# Altium schematic sheet Sensor_PCI_Sch_V2.SchDoc
size 342 x 292 mm; SheetNumber: 1; SheetTotal: 1
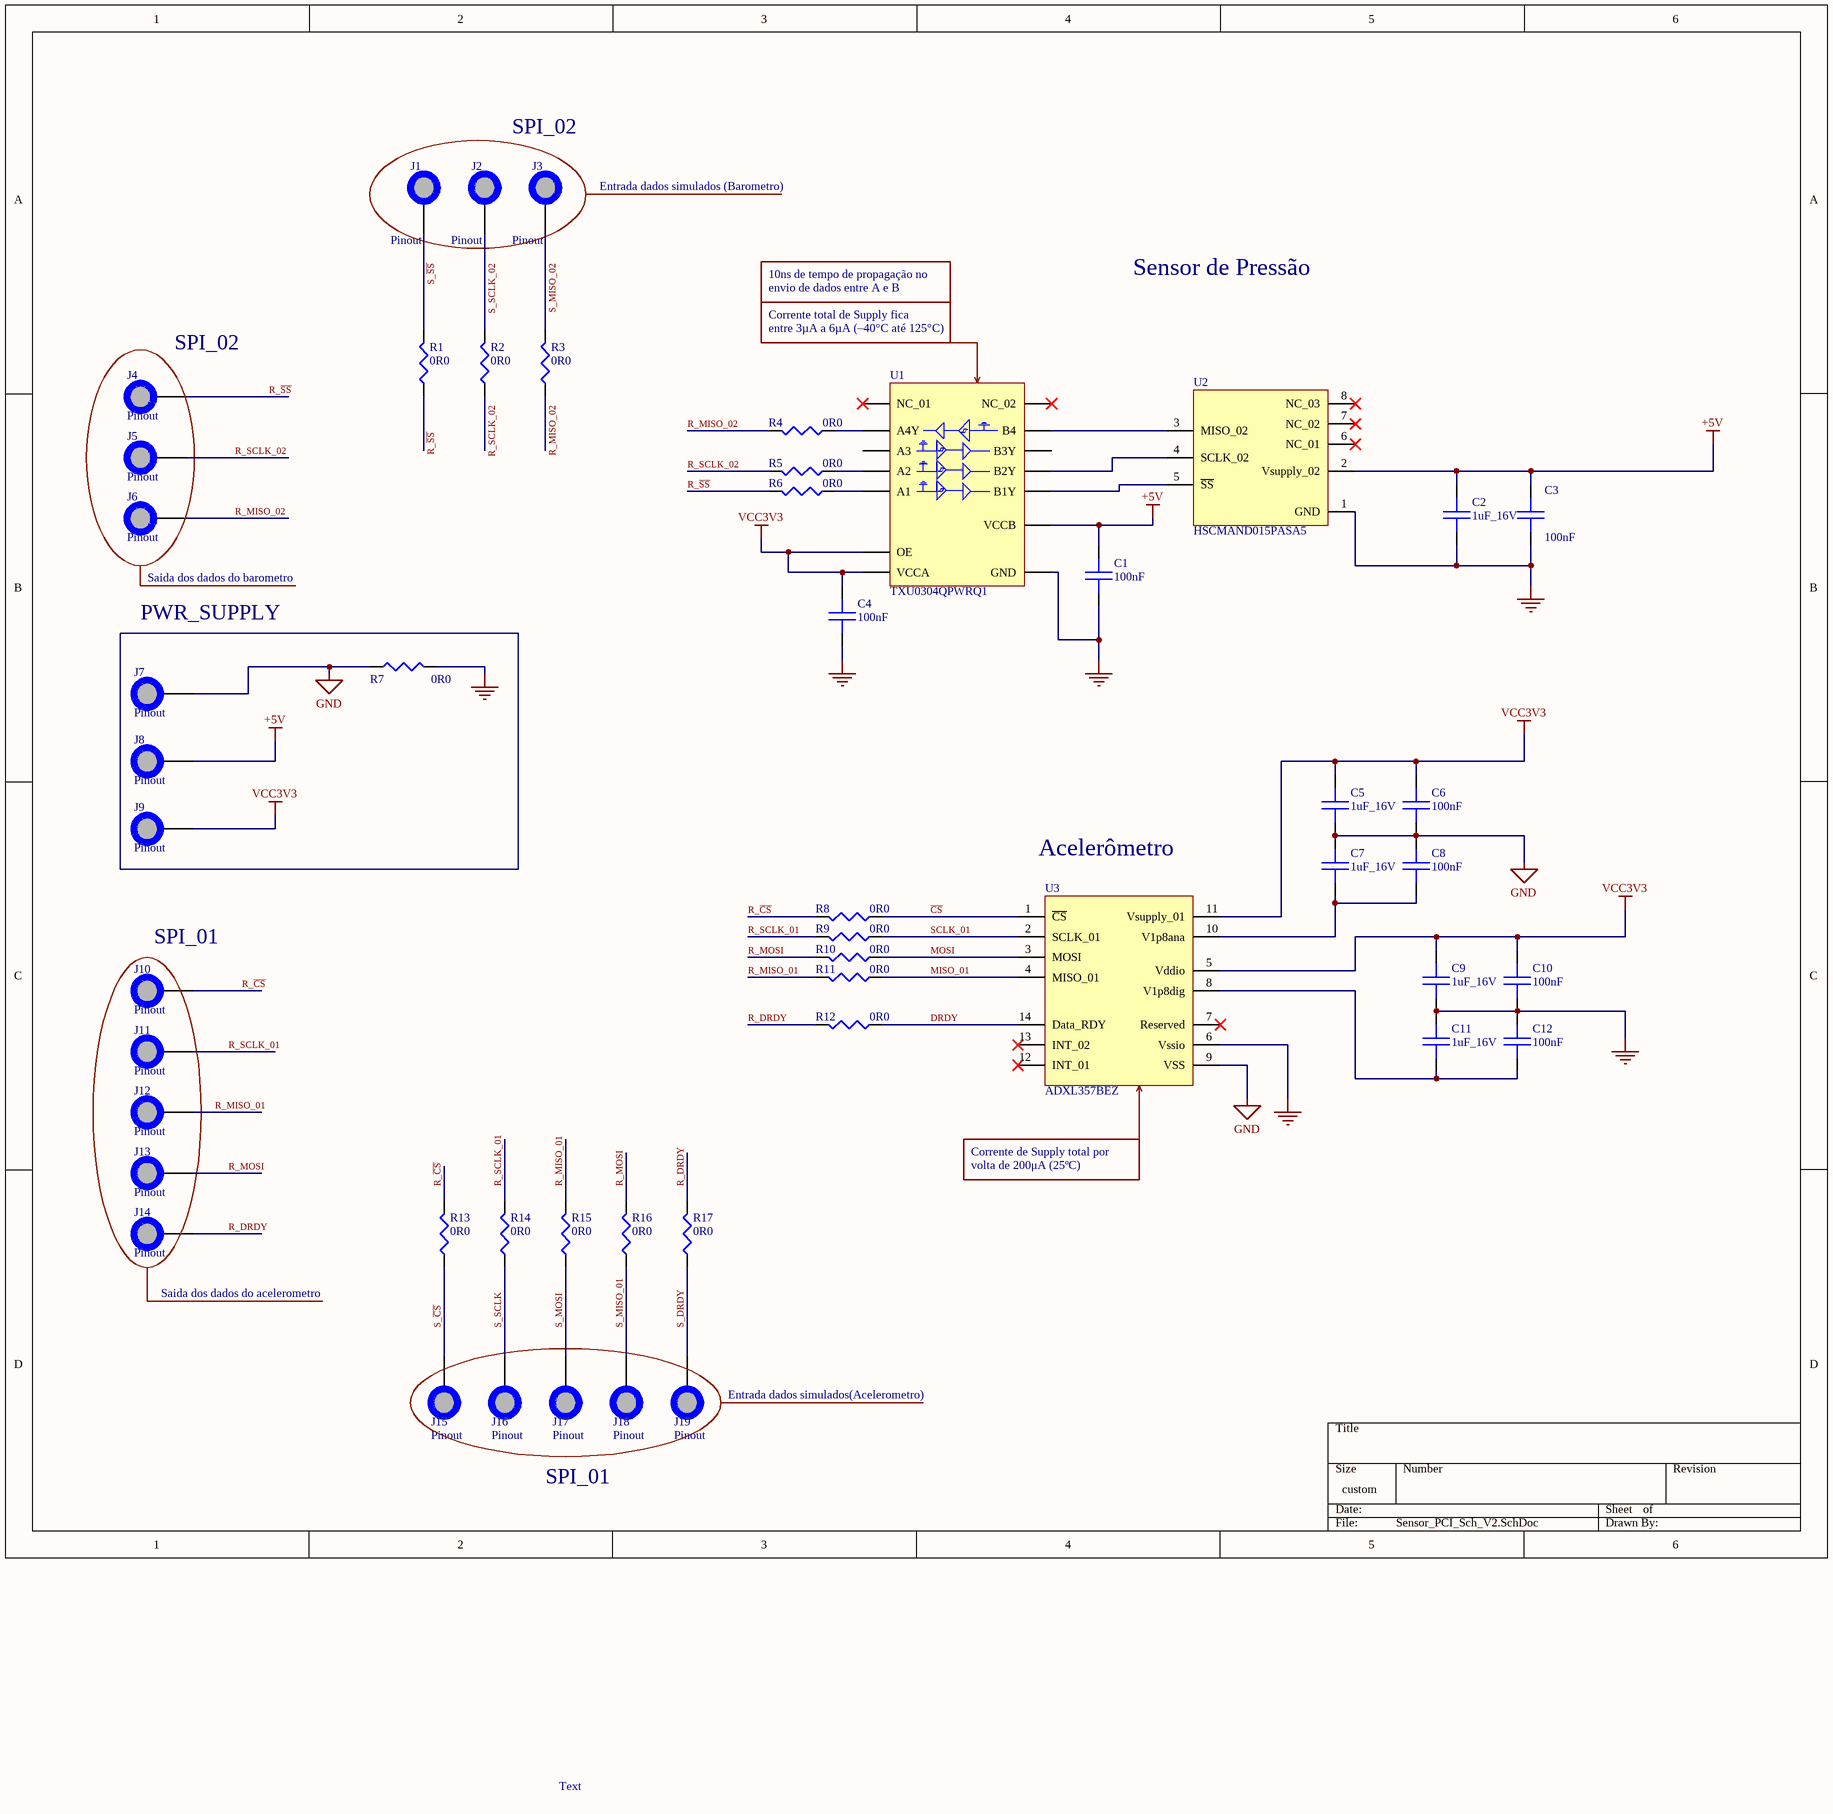
[diagram p0: Sensor_PCI_Sch_V2.SchDoc]

## Parts
C1  100nF  [CP_0805]
C2  1uF_16V  [C_1206]
C3  100nF  [CP_0805]
C4  100nF  [CP_0805]
C5  1uF_16V  [C_1206]
C6  100nF  [CP_0805]
C7  1uF_16V  [C_1206]
C8  100nF  [CP_0805]
C9  1uF_16V  [C_1206]
C10  100nF  [CP_0805]
C11  1uF_16V  [C_1206]
C12  100nF  [CP_0805]
J1  Pinout  [Pinout]
J2  Pinout  [Pinout]
J3  Pinout  [Pinout]
J4  Pinout  [Pinout]
J5  Pinout  [Pinout]
J6  Pinout  [Pinout]
J7  Pinout  [Pinout]
J8  Pinout  [Pinout]
J9  Pinout  [Pinout]
J10  Pinout  [Pinout]
J11  Pinout  [Pinout]
J12  Pinout  [Pinout]
J13  Pinout  [Pinout]
J14  Pinout  [Pinout]
J15  Pinout  [Pinout]
J16  Pinout  [Pinout]
J17  Pinout  [Pinout]
J18  Pinout  [Pinout]
J19  Pinout  [Pinout]
R1  0R0  [R_0805]
R2  0R0  [R_0805]
R3  0R0  [R_0805]
R4  0R0  [R_0805]
R5  0R0  [R_0805]
R6  0R0  [R_0805]
R7  0R0  [R_0805]
R8  0R0  [R_0805]
R9  0R0  [R_0805]
R10  0R0  [R_0805]
R11  0R0  [R_0805]
R12  0R0  [R_0805]
R13  0R0  [R_0805]
R14  0R0  [R_0805]
R15  0R0  [R_0805]
R16  0R0  [R_0805]
R17  0R0  [R_0805]
U1  TXU0304QPWRQ1  [TSSOP-PW]
U2  HSCMAND015PASA5  [SMT_08_2.54mm]
U3  ADXL357BEZ  [Quad_14_1.2mm]

## Blocks framed on the sheet
PWR_SUPPLY: J7-J9 R7

## Nets
+5V: C1.2 C2.1 C3.2 J8.1 U1.14(VCCB) U2.2(Vsupply_02)
GND: C1.1 C2.2 C3.1 C4.1 C5.2 C6.1 C7.1 C8.2 C9.2 C10.1 C11.1 C12.2 J7.1 R7.1 R7.2 U1.7(GND) U2.1(GND) U3.6(Vssio) U3.9(VSS)
VCC3V3: C4.2 C5.1 C6.2 C9.1 C10.2 J9.1 U1.1(VCCA) U1.8(OE) U3.5(Vddio) U3.11(Vsupply_01)
~{CS}: R8.1 U3.1(~{CS})
DRDY: R12.1 U3.14(Data_RDY)
MISO_01: R11.1 U3.4(MISO_01)
MOSI: R10.1 U3.3(MOSI)
R_~{CS}: J10.1 R8.2 R13.2
R_DRDY: J14.1 R12.2 R17.2
R_MISO_01: J12.1 R11.2 R15.2
R_MISO_02: J6.1 R3.1 R4.2
R_MOSI: J13.1 R10.2 R16.2
R_~{SS}: J4.1 R1.1 R6.2
R_SCLK_01: J11.1 R9.2 R14.2
R_SCLK_02: J5.1 R2.1 R5.2
S_~{CS}: J15.1 R13.1
S_DRDY: J19.1 R17.1
S_MISO_01: J18.1 R16.1
S_MISO_02: J3.1 R3.2
S_MOSI: J17.1 R15.1
S_~{SS}: J1.1 R1.2
S_SCLK: J16.1 R14.1
S_SCLK_02: J2.1 R2.2
SCLK_01: R9.1 U3.2(SCLK_01)
NetC7_2: C7.2 C8.1 U3.10(V1p8ana)
NetC11_2: C11.2 C12.1 U3.8(V1p8dig)
NetR4_1: R4.1 U1.5(A4Y)
NetR5_1: R5.1 U1.3(A2)
NetR6_1: R6.1 U1.2(A1)
NetU1_10: U1.10(B4) U2.3(MISO_02)
NetU1_12: U1.12(B2Y) U2.4(SCLK_02)
NetU1_13: U1.13(B1Y) U2.5(~{SS})

Not connected (* = marked no-connect by the designer): U1 4(A3) 6(NC_01)* 9(NC_02)* 11(B3Y); U2 6(NC_01)* 7(NC_02)* 8(NC_03)*; U3 7(Reserved)* 12(INT_01)* 13(INT_02)*

## Notes on the sheet
- SPI_02
- Entrada dados simulados (Barometro)
- 10ns de tempo de propagação no
- envio de dados entre A e B
- Sensor de Pressão
- (near J4) SPI_02
- Corrente total de Supply fica
- entre 3µA a 6µA (–40°C até 125°C)
- Saida dos dados do barometro
- Acelerômetro
- (near J10) SPI_01
- Corrente de Supply total por
- volta de 200μA (25ºC)
- Saida dos dados do acelerometro
- (near J19) Entrada dados simulados(Acelerometro)
- SPI_01
- Text

## Library data of the parts
C1 C3 C4 C6 C8 C10 C12 = C_0805_0.1uF: Cap Ceramic 0.1uF 50V X7R 20% Pad SMD 0805 150°C T/R; Manufacturer: Vishay Vitramon; Manufacturer Part Number: VJ0805Y104MXAMR; Supplier 1: Mouser; RoHS: Yes; Category: Ceramic Capacitors; Stock 1: 26836; Pricing 1: 1=0,33000, 10=0,23700, 50=0,23700, 100=0,14200, 1000=0,09000, 10000=0,07300 (USD); Mount: Surface Mount; Case/Package: 0805; Case Code (Imperial): 0805; Case Code (Metric): 2012; Min Operating Temperature: -55°C; Max Operating Temperature: 150°C; Capacitance: 100nF; Voltage Rating (DC): 50V; Tolerance: 20%; Packaging: Tape and Reel; Package Quantity: 10000; Dielectric: X7R; Termination: SMD/SMT; Series: VJ COMM; Construction: Flat; Length: 2mm; Width: 1.25mm; Height: 1.45mm; Depth: 1.25mm; RoHS Compliant: Yes; ComponentLink1URL: http://www.mouser.com/ds/2/427/vjcommercialseries-222796.pdf?src-supplier=Mouser; ComponentLink1Description: http://www.mouser.com/ds/2/427/vjcommercialseries-222796.pdf?src-supplier=Mouser; ComponentLink2URL: http://www.vishay.com/docs/45199/commseri.pdf?src-supplier=Avnet; ComponentLink2Description: http://www.vishay.com/docs/45199/commseri.pdf?src-supplier=Avnet; ComponentLink3URL: http://www.vishay.com/docs/45199/vjcommercialseries.pdf?src-supplier=Digi-Key; ComponentLink3Description: http://www.vishay.com/docs/45199/vjcommercialseries.pdf?src-supplier=Digi-Key; ComponentLink4URL: http://www.vishay.com/docs/45051/vjvitramonpackaging.pdf?src-supplier=Digi-Key; ComponentLink4Description: http://www.vishay.com/docs/45051/vjvitramonpackaging.pdf?src-supplier=Digi-Key; Supplier Part Number 1: 77-VJ0805Y104MXAMR
C2 C5 C7 C9 C11 = C_1206_1uF_16V: Cap Ceramic 1uF 16V Y5V 20% SMD 1206 85°C Plastic T/R; Manufacturer: Vishay Vitramon; Manufacturer Part Number: VJ1206V105MXJTW1BC; Dielectric Material: Tantalum; Supplier 1: Mouser; RoHS: Yes; Category: Ceramic Capacitors; Stock 1: 370; Pricing 1: 1=0,44000, 10=0,31000, 50=0,31000, 100=0,18600, 1000=0,11800, 10000=0,09500 (USD); Mount: Surface Mount; Case/Package: 1206; Case Code (Metric): 3216; Case Code (Imperial): 1206; Weight: 0.000571oz; Min Operating Temperature: -25°C; Max Operating Temperature: 85°C; Capacitance: 1uF; Tolerance: 20%; Packaging: Tape and Reel; Package Quantity: 3000; Voltage Rating (DC): 16V; Dielectric: Y5V; Termination: SMD/SMT; Series: VJ W1BC; Construction: Flat; Length: 3.2mm; Width: 1.6mm; Height: 1.9mm; Depth: 1.6mm; Lead Free: Lead Free; ComponentLink1URL: https://datasheet.ciiva.com/5418/vjw1bcbascomseries-223529-5418534.pdf?src-supplier=Mouser; ComponentLink1Description: https://datasheet.ciiva.com/5418/vjw1bcbascomseries-223529-5418534.pdf?src-supplier=Mouser; Supplier Part Number 1: 77-VJ1206V105MXJTBC
R1-R17 = Res_0805_0R0: CRCW Thick Film Commodity Chip Resistor Jumper 0805 Size 0 Ohm 0.125 W 2-Pin SMD Paper T/R; Manufacturer: Vishay Dale; Manufacturer Part Number: CRCW08050000Z0ECC; Resistance: 0mR; Max Power Dissipation: 125mW; Supplier 1: Mouser; RoHS: Yes; Category: Chip SMD Resistors; Stock 1: 327854; Pricing 1: 1=0,10000, 10=0,04200, 50=0,04200, 100=0,01700, 1000=0,00800, 10000=0,00500 (USD); Case/Package: 0805; Case Code (Imperial): 0805; Case Code (Metric): 2012; Min Operating Temperature: -55°C; Max Operating Temperature: 155°C; Resistor Type: Thick Film; Packaging: Tape and Reel; Number of Terminations: 2; RoHS Compliant: Yes; ComponentLink1URL: http://www.vishay.com/docs/28773/crcwce3.pdf?src-supplier=Digi-Key; ComponentLink1Description: http://www.vishay.com/docs/28773/crcwce3.pdf?src-supplier=Digi-Key; Supplier Part Number 1: 71-CRCW08050000Z0ECC
U1 = Tradutor fixo de Tensão-SPI: Automotive four channel unidirectional level shifter 14-TSSOP -40 to 125; Manufacturer: Texas Instruments; Supplier 1: Mouser; Manufacturer Part Number: TXU0304QPWRQ1; RoHS: Yes; Category: Voltage Level Shifters; Stock 1: 21654; Pricing 1: 1=1,03000, 10=0,92300, 25=0,87600, 50=0,87600, 100=0,72000, 250=0,67300, 500=0,59500, 1000=0,46900, 2000=0,45300, 10000=0,45300 (USD); Supplier Part Number 1: 595-TXU0304QPWRQ1
U2 = Sensor_Pressão: Board Mount Pressure Sensors SMT, Single Ax Barbed Absolute, 5V; Manufacturer: Honeywell Sensing & Control; Nominal Supply Current: 2mA; Max Supply Voltage: 5.25V; Min Supply Voltage: 4.75V; Operating Pressure: 15PSI; Max Pressure: 30PSI; Accuracy: 0.25%; Max Supply Current: 3mA; Response Time: 1ms; Output Type: SPI,Digital; Supplier 1: Mouser; Manufacturer Part Number: HSCMAND015PASA5; RoHS: Yes; Category: Pressure Sensors; Stock 1: 87; Pricing 1: 1=71,24000, 10=67,05000, 50=60,77000, 100=57,41000, 1000=57,41000, 10000=57,41000 (USD); Mount: Surface Mount; Case/Package: SMD/SMT; Number of Pins: 8; Min Operating Temperature: -20°C; Max Operating Temperature: 85°C; Package Quantity: 1; Operating Supply Voltage: 5V; Termination: Gull Wing; Port Style: Barbed; Voltage Rating (DC): 5V; Pressure Type: Absolute; Series: TruStability® HSC; Supply Current: 2mA; RoHS Compliant: Yes; ComponentLink1URL: https://datasheet.ciiva.com/2826/honeywell-sensing-board-mount-pressure-sensors-line-guide-008152-16-en-2826384.pdf?src-supplier=Digi-Key; ComponentLink1Description: https://datasheet.ciiva.com/2826/honeywell-sensing-board-mount-pressure-sensors-line-guide-008152-16-en-2826384.pdf?src-supplier=Digi-Key; ComponentLink2URL: https://datasheet.ciiva.com/1319/1676934-1319217.pdf?src-supplier=Element14; ComponentLink2Description: https://datasheet.ciiva.com/1319/1676934-1319217.pdf?src-supplier=Element14; Supplier Part Number 1: 785-HSCMAND015PASA5
U3 = Acelerômetro: Accelerometer Tri-axis Digital Accel; Manufacturer: Analog Devices; Output Type: SPI,I2C; Axis: X, Y, Z; Bandwidth: 1Hz; Supplier 1: Mouser; Manufacturer Part Number: ADXL357BEZ; RoHS: Yes; Category: Accelerometers; Stock 1: 9624; Pricing 1: 1=73,06000, 10=66,41000, 50=66,41000, 100=66,41000, 1000=66,41000, 10000=66,41000 (USD); Mount: Surface Mount; Case/Package: CLCC; Number of Pins: 14; Min Operating Temperature: -40°C; Max Operating Temperature: 125°C; Packaging: Tray; RoHS Compliant: Yes; ComponentLink1URL: http://www.farnell.com/datasheets/2261940.pdf?src-supplier=Farnell; ComponentLink1Description: http://www.farnell.com/datasheets/2261940.pdf?src-supplier=Farnell; ComponentLink2URL: https://www.analog.com/media/en/technical-documentation/data-sheets/ADXL356-357.pdf?src-supplier=Digi-Key; ComponentLink2Description: https://www.analog.com/media/en/technical-documentation/data-sheets/ADXL356-357.pdf?src-supplier=Digi-Key; Supplier Part Number 1: 584-ADXL357BEZ